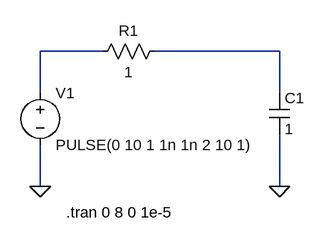
[diagram p0: schematic RC_resp_comp_Laplace.asc]
RC_resp_comp_Laplace.asc, the LTspice schematic file:
Version 4
SHEET 1 880 680
WIRE 112 48 16 48
WIRE 384 48 192 48
WIRE 16 112 16 48
WIRE 384 112 384 48
WIRE 16 256 16 192
WIRE 384 256 384 176
FLAG 16 256 0
FLAG 384 256 0
SYMBOL voltage 16 96 R0
WINDOW 123 0 0 Left 0
WINDOW 39 0 0 Left 0
SYMATTR InstName V1
SYMATTR Value PULSE(0 10 1 1n 1n 2 10 1)
SYMBOL res 96 64 R270
WINDOW 0 32 56 VTop 2
WINDOW 3 0 56 VBottom 2
SYMATTR InstName R1
SYMATTR Value 1
SYMBOL cap 368 112 R0
SYMATTR InstName C1
SYMATTR Value 1
TEXT 56 296 Left 2 !.tran 0 8 0 1e-5

The netlist it stands for:
* RC_resp_comp_Laplace.asc
V1 N001 0 PULSE(0 10 1 1n 1n 2 10 1)
R1 N001 N002 1
C1 N002 0 1
.tran 0 8 0 1e-5
.backanno
.end